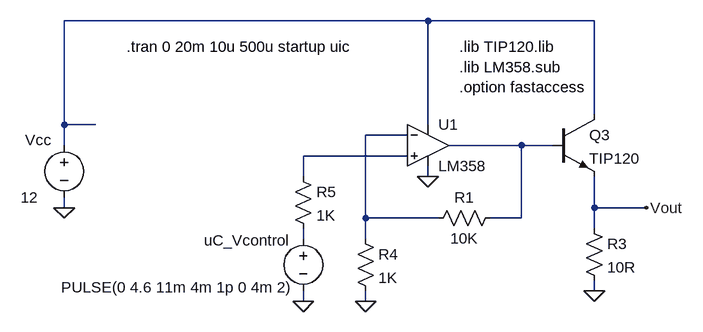
[diagram p0: schematic LM358 Amp.asc]
LM358 Amp.asc, the LTspice schematic file:
Version 4
SHEET 1 1872 740
WIRE 624 -288 64 -288
WIRE 880 -288 624 -288
WIRE 880 -144 880 -288
WIRE 64 -128 64 -288
WIRE 112 -128 64 -128
WIRE 624 -128 624 -288
WIRE 592 -112 528 -112
WIRE 64 -96 64 -128
WIRE 768 -96 656 -96
WIRE 816 -96 768 -96
WIRE 592 -80 432 -80
WIRE 432 -48 432 -80
WIRE 624 -48 624 -64
WIRE 64 0 64 -16
WIRE 880 0 880 -48
WIRE 960 0 880 0
WIRE 528 16 528 -112
WIRE 640 16 528 16
WIRE 768 16 768 -96
WIRE 768 16 720 16
WIRE 880 32 880 0
WIRE 432 48 432 32
WIRE 528 48 528 16
WIRE 880 128 880 112
WIRE 432 144 432 128
WIRE 528 144 528 128
FLAG 64 0 0
FLAG 960 0 Vout
FLAG 880 128 0
FLAG 528 144 0
FLAG 624 -48 0
FLAG 432 144 0
SYMBOL voltage 64 -112 R0
WINDOW 0 -60 8 Left 2
WINDOW 3 -67 96 Left 2
SYMATTR InstName Vcc
SYMATTR Value 12
SYMBOL npn 816 -144 R0
SYMATTR InstName Q3
SYMATTR Value TIP120
SYMATTR Prefix X
SYMBOL OpAmps\\opamp2 624 -160 R0
SYMATTR InstName U1
SYMATTR Value LM358
SYMBOL res 736 0 R90
WINDOW 0 0 56 VBottom 2
WINDOW 3 32 56 VTop 2
SYMATTR InstName R1
SYMATTR Value 10K
SYMBOL res 864 16 R0
SYMATTR InstName R3
SYMATTR Value 10R
SYMBOL res 512 32 R0
SYMATTR InstName R4
SYMATTR Value 1K
SYMBOL res 416 -64 R0
SYMATTR InstName R5
SYMATTR Value 1K
SYMBOL voltage 432 32 R0
WINDOW 0 -153 18 Left 2
WINDOW 3 -373 91 Left 2
WINDOW 123 0 0 Left 2
WINDOW 39 0 0 Left 2
SYMATTR InstName uC_Vcontrol
SYMATTR Value PULSE(0 4.6 11m 4m 1p 0 4m 2)
TEXT 160 -248 Left 2 !.tran 0 20m 10u 500u startup uic
TEXT 672 -248 Left 2 !.lib TIP120.lib\n.lib LM358.sub\n.option fastaccess

The netlist it stands for:
* LM358 Amp.asc
Vcc N001 0 12
XQ3 N001 N003 Vout TIP120  ; pins C B E
XU1 N004 N002 N001 0 N003 LM358  ; pins In+ In- V+ V- OUT
R1 N003 N002 10K
R3 Vout 0 10R
R4 N002 0 1K
R5 N004 N005 1K
V§uC_Vcontrol N005 0 PULSE(0 4.6 11m 4m 1p 0 4m 2)
.tran 0 20m 10u 500u startup uic
.lib TIP120.lib
.lib LM358.sub
.option fastaccess
.backanno
.end